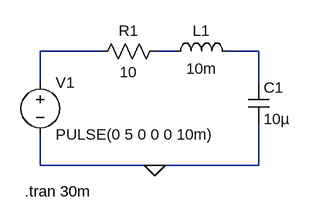
[diagram p0: schematic ex1.asc]
ex1.asc, the LTspice schematic file:
Version 4
SHEET 1 880 680
WIRE 192 96 96 96
WIRE 304 96 272 96
WIRE 432 96 384 96
WIRE 96 144 96 96
WIRE 432 144 432 96
WIRE 96 272 96 224
WIRE 272 272 96 272
WIRE 432 272 432 208
WIRE 432 272 272 272
FLAG 272 272 0
SYMBOL voltage 96 128 R0
WINDOW 123 0 0 Left 2
WINDOW 39 0 0 Left 2
SYMATTR InstName V1
SYMATTR Value PULSE(0 5 0 0 0 10m)
SYMBOL res 176 112 R270
WINDOW 0 32 56 VTop 2
WINDOW 3 0 56 VBottom 2
SYMATTR InstName R1
SYMATTR Value 10
SYMBOL ind 288 112 R270
WINDOW 0 32 56 VTop 2
WINDOW 3 5 56 VBottom 2
SYMATTR InstName L1
SYMATTR Value 10m
SYMBOL cap 416 144 R0
SYMATTR InstName C1
SYMATTR Value 10µ
TEXT 72 312 Left 2 !.tran 30m

The netlist it stands for:
* ex1.asc
V1 N001 0 PULSE(0 5 0 0 0 10m)
R1 N001 N002 10
L1 N002 N003 10m
C1 N003 0 10µ
.tran 30m
.backanno
.end